# EasyEDA Pro project 转接隔离板.eprj

# Schematic 原理图

## Sheets
1 主控MCU: Board Name: 转接隔离板; Create Date: 2024-04-22; Page Name: 主控MCU; Project Name: 转接隔离板; Schematic Name: 原理图; Update Date: 2025-02-13; Company: 嘉立创EDA; Page Size: A3; Version: V1.0
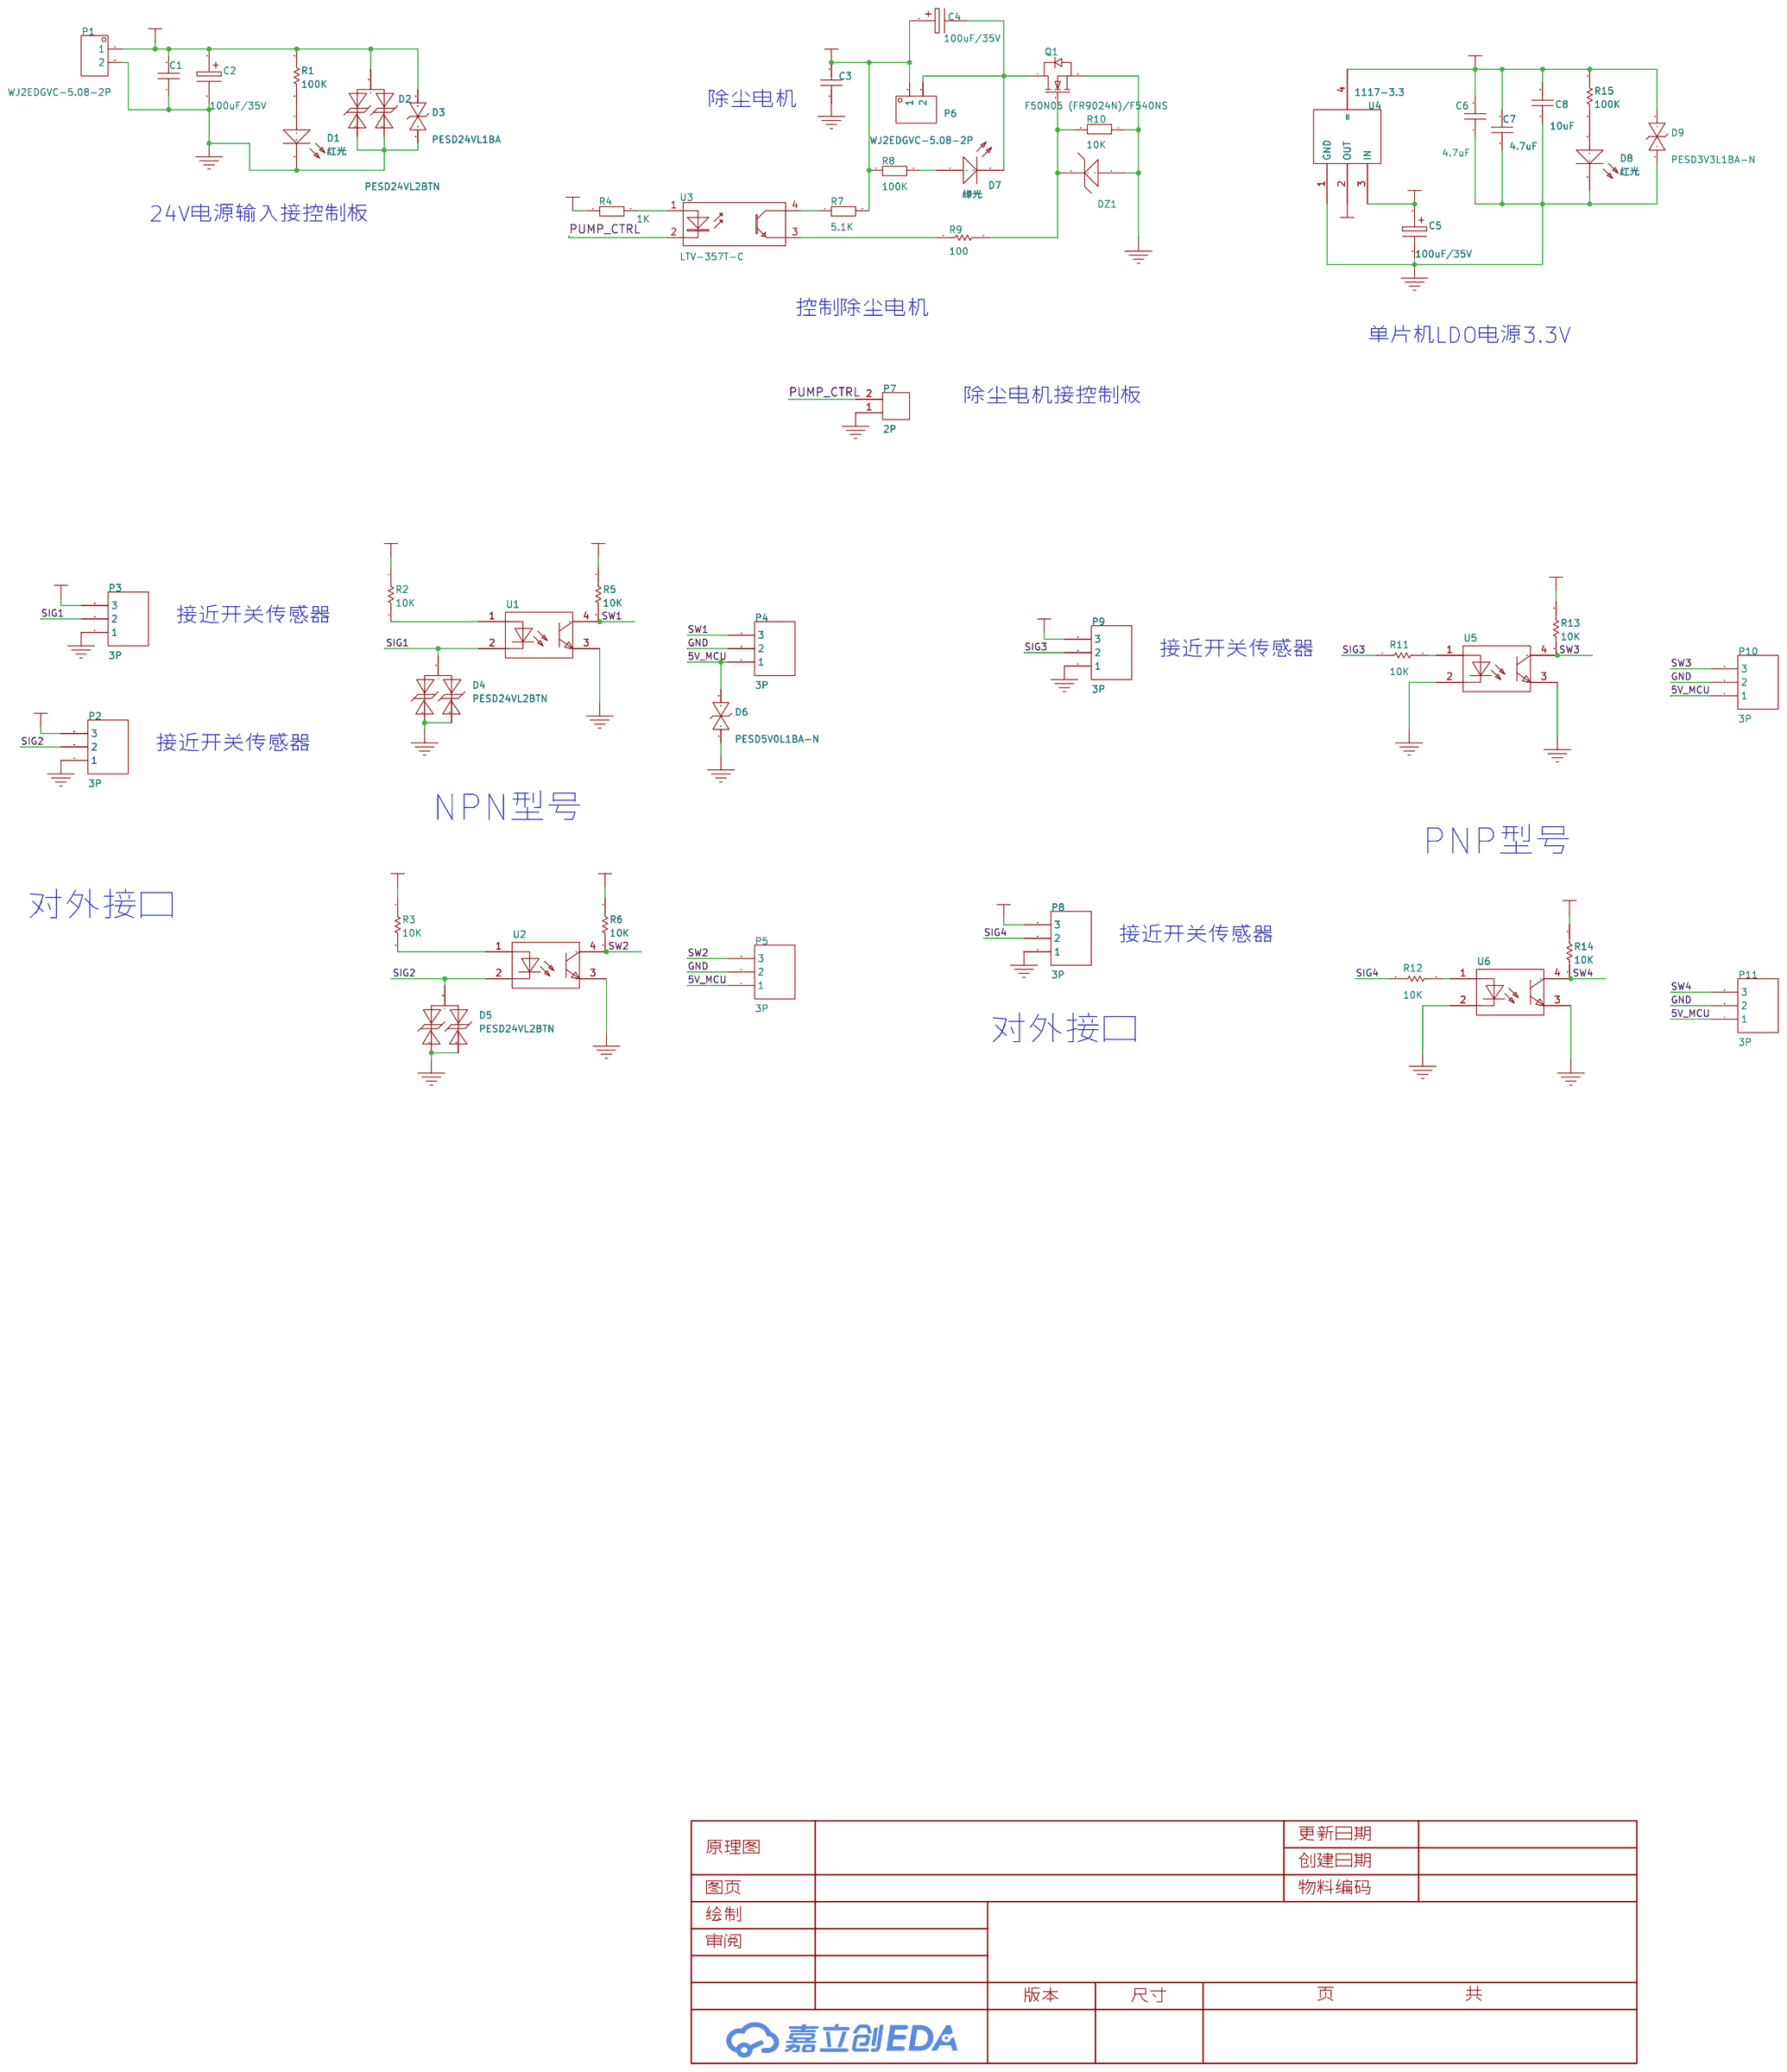
[diagram p0: 主控MCU]
2 电源及控制: Create Date: 2024-12-30; Page Name: 电源及控制; Update Date: 2025-01-07
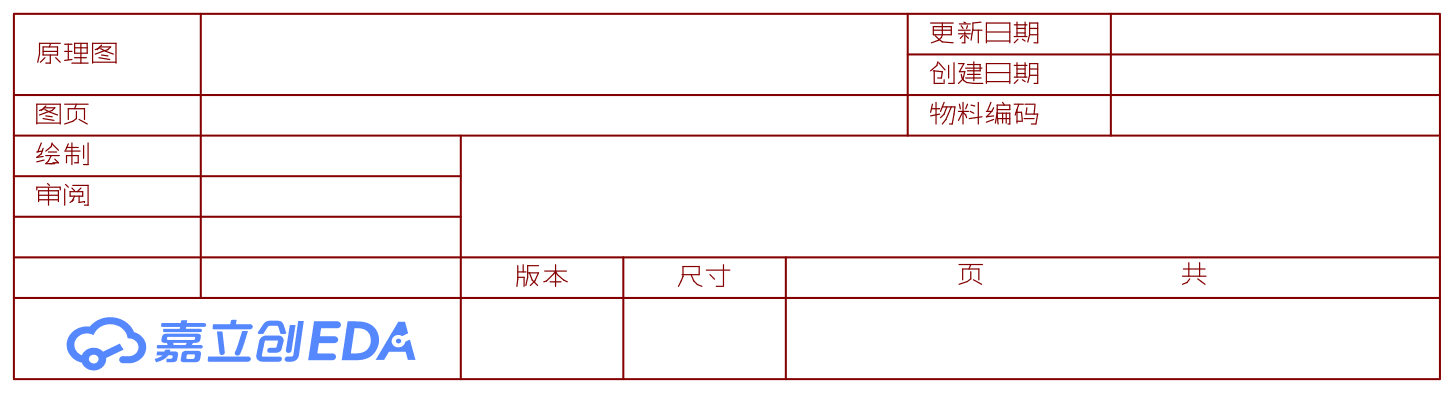
[diagram p1: 电源及控制]

## Parts
C1  104  [0603C]
C2  100uF/35V  [电解电容贴片6x6]
C3  104  [0603C]
C4  100uF/35V  [电解电容贴片6X6]
C5  100uF/35V  [电解电容贴片6X6]
C6  4.7uF  [C0805]
C7  4.7uF  [C0805]
C8  10uF  [C1206]
D1  红光  [0603LED]
D2  PESD24VL2BTN  [SOT-23-3_L2.9-W1.6-P1.90-LS2.8-BR]
D3  PESD24VL1BA  [SOD-323_L1.7-W1.3-LS2.5-BI]
D4  PESD24VL2BTN  [SOT-23-3_L2.9-W1.6-P1.90-LS2.8-BR]
D5  PESD24VL2BTN  [SOT-23-3_L2.9-W1.6-P1.90-LS2.8-BR]
D6  PESD5V0L1BA-N  [SOD-323_L1.7-W1.3-LS2.5-BI]
D7  绿光  [0603LED]
D8  红光  [0603LED]
D9  PESD3V3L1BA-N  [SOD-323_L1.7-W1.3-LS2.5-BI]
DZ1  --ѹ------SMAZ10V  [SMA]
P1  WJ2EDGVC-5.08-2P  [CONN-TH_WJ2EDGVC-5.08-2P]
P2  3P  [HDR1X3_CON]
P3  3P  [HDR1X3_CON]
P4  3P  [HDR1X3_CON]
P5  3P  [HDR1X3_CON]
P6  WJ2EDGVC-5.08-2P  [CONN-TH_WJ2EDGVC-5.08-2P]
P7  2P  [HDR1X2_CON]
P8  3P  [HDR1X3_CON]
P9  3P  [HDR1X3_CON]
P10  3P  [HDR1X3_CON]
P11  3P  [HDR1X3_CON]
Q1  F50N06 (FR9024N)/F540NS  [TO-263-2_L10.0-W9.1-P5.08-LS15.2-TL]
R1  100K  [0603R]
R2  10K  [0603R]
R3  10K  [0603R]
R4  1K  [0603R]
R5  10K  [0603R]
R6  10K  [0603R]
R7  5.1K  [0603R]
R8  100K  [0603R]
R9  100  [0603R]
R10  10K  [0603R]
R11  10K  [0603R]
R12  10K  [0603R]
R13  10K  [0603R]
R14  10K  [0603R]
R15  100K  [0603R]
U1  LTV-357T-C  [SOP-4_L4.4-W3.9-P2.54-LS7.0-TL]
U2  LTV-357T-C  [SOP-4_L4.4-W3.9-P2.54-LS7.0-TL]
U3  LTV-357T-C  [SOP-4_L4.4-W3.9-P2.54-LS7.0-TL]
U4  1117-3.3  [SOT-223]
U5  LTV-357T-C  [SOP-4_L4.4-W3.9-P2.54-LS7.0-TL]
U6  LTV-357T-C  [SOP-4_L4.4-W3.9-P2.54-LS7.0-TL]

## Library data of the parts
C1 C3 = 104: Origin Footprint 2: CAP; Origin Footprint 3: 0805C; Design Item ID: CAP; Library Name: SCH封装库
C2 = 100uF/35V: Origin Footprint 2: X47U; Origin Footprint 1: ________Ƭ6x6; Design Item ID: ELECTRO1; Library Name: *
C4 C5 = 100uF/35V: Origin Footprint 2: X47U; Origin Footprint 1: 电解电容贴片6x6; Design Item ID: ELECTRO1; Library Name: *
C6 C7 = 1206B475K500NT: 容值:4.7uF;精度:±10%;额定电压:50V;材质(温度系数):X7R;; LCSC Part Name: 4.7uF±10%50V; Supplier Part: C29823; Manufacturer: FH(风华); Supplier Footprint: 1206; JLCPCB Part Class: 基础库; Datasheet: https://atta.szlcsc.com/upload/public/pdf/source/20200305/C486355_26A10D38EF8C2A5C37091D0039909270.pdf; Supplier: LCSC; Tolerance: ±10%; Voltage Rated: 50V; Temperature Coefficient: X7R
C8 = 104: Capacitor (Semiconductor SIM Model); Published: 8-Jun-2000; LatestRevisionDate: 17-Jul-2002; LatestRevisionNote: Re-released for DXP Platform.; Publisher: Altium Limited; Origin Footprint 3: 0402; Origin Footprint 4: 1310[0504]; Origin Footprint 5: 1608[0603]; Origin Footprint 6: C1210; Origin Footprint 7: C0805; Origin Footprint 9: 0805; Origin Footprint 10: 0805L; Origin Footprint 1: 0603C; Design Item ID: Cap Semi; Library Name: Miscellaneous Devices
D1 D8 = 红光: Origin Footprint 2: LED(小); Design Item ID: LED; Library Name: SCH封装库
D2 D4 D5 = PESD24VL2BTN: Supplier Part: C314266; Manufacturer: BORN伯恩半导体; Supplier Footprint: SOT-23; JLCPCB Part Class: Extended Part; Datasheet: https://atta.szlcsc.com/upload/public/pdf/source/20181015/C314266_827961A24CE19193E9C29A410C67A84F.pdf; Supplier: LCSC; Polarity: Bidirectional; Voltage - Reverse Standoff (Typ): 24V (Max); Voltage - Breakdown (Min): 26.7V; Voltage - Clamping (Max) @ Ipp: 48V; Current - Peak Pulse (10/1000μs): 6A (8/20us)
D3 D6 D9 = PESD03V32D-LC: 极性:双向;反向截止电压(Vrwm):3.3V;最大钳位电压:16V;击穿电压:4V;; Supplier Part: C2912528; Manufacturer: TECH PUBLIC(台舟); Supplier Footprint: SOD-323; JLCPCB Part Class: 扩展库; Datasheet: https://atta.szlcsc.com/upload/public/pdf/source/20211102/817A196708C9E8A6CC27A16BC0CC1C1B.pdf; Supplier: LCSC; polarity: 双向; Reverse Stand-Off Voltage (Vrwm): 3.3V; Maximum Clamping Voltage: 16V; Breakdown Voltage: 4V; Reverse Leakage Current (Ir): 200nA; Number of Lines: 单路
D7 = 绿光: Origin Footprint 2: LED(小); Design Item ID: LED; Library Name: SCH封装库
DZ1 = ��ѹ������SMAZ10V: Design Item ID: --ѹ------; Library Name: SCH--װ--
P1 P6 = WJ2EDGVC-5.08-2P: LCSC Part Name: 1x2P 5.08mm 排数:1 每排P数:2; Supplier Part: C8445; Manufacturer: KANGNEX(康奈克斯电气); Supplier Footprint: 插件,P=5.08mm; JLCPCB Part Class: 扩展库; Datasheet: https://atta.szlcsc.com/upload/public/pdf/source/20191225/C8445_EB1D2D396D429FBA4C627FE17CC77AF0.pdf; Supplier: LCSC; Connector Type: 板端/插座-闭口; Structure: 1x2P; Pitch: 5.08mm; Color: 绿色; Mounting Style: 直针; Number of Pins: 2P; Number of Rows: 1; Number of PINs Per Row: 2; Current Rating (Max): 20A; Voltage Rating (Max): 450V; Contact Material: 黄铜; Contact Plating: 锡; Operating Temperature Range: -40℃~+105℃
P2-P5 P8-P11 = 3P: Library Name: SCH封装库
P7 = 2P: Library Name: SCH--װ--
Q1 = IRF540NSTRLPBF: LCSC Part Name: N沟道 100V 33A; Supplier Part: C23982; Manufacturer: Infineon(英飞凌); Supplier Footprint: D2PAK; JLCPCB Part Class: Extended Part; Datasheet: https://atta.szlcsc.com/upload/public/pdf/source/20140304/1457707006167.pdf; Supplier: LCSC; Type: N沟道; Drain Source Voltage (Vdss): 100V; Continuous Drain Current (Id): 33A; Power Dissipation (Pd): 130W; Drain Source On Resistance (RDS(on)@Vgs,Id): 44mΩ@10V,16A; Gate Threshold Voltage (Vgs(th)@Id): 4V@250μA
R1 R15 = 1K: Resistor; Published: 8-Jun-2000; LatestRevisionDate: 17-Jul-2002; LatestRevisionNote: Re-released for DXP Platform.; PackageReference: AXIAL-0.3; Publisher: Altium Limited; Origin Footprint 2: AXIAL-0.3; Origin Footprint 3: R0805; Origin Footprint 4: 0805R; Design Item ID: RES; Library Name: SCH封装库
R2 R3 R11 R12 = 470Ω: Resistor; Published: 8-Jun-2000; LatestRevisionDate: 17-Jul-2002; LatestRevisionNote: Re-released for DXP Platform.; PackageReference: AXIAL-0.3; Publisher: Altium Limited; Origin Footprint 2: AXIAL-0.3; Origin Footprint 3: R0805; Origin Footprint 4: 0805R; Design Item ID: RES; Library Name: SCH封装库
R4 = 2k: Origin Footprint 2: res; Origin Footprint 3: RES2; Origin Footprint 4: AXIAL-0.4; Origin Footprint 5: 0805R; Design Item ID: res; Library Name: MYLIB
R5 R6 R13 R14 = 10K: Resistor; Published: 8-Jun-2000; LatestRevisionDate: 17-Jul-2002; LatestRevisionNote: Re-released for DXP Platform.; PackageReference: AXIAL-0.3; Publisher: Altium Limited; Origin Footprint 2: AXIAL-0.3; Origin Footprint 3: R0805; Origin Footprint 4: 0805R; Design Item ID: RES; Library Name: SCH封装库
R7 = 5.1K: Origin Footprint 2: res; Origin Footprint 3: RES2; Origin Footprint 4: AXIAL-0.4; Origin Footprint 5: 0805R; Design Item ID: res; Library Name: MYLIB
R8 R10 = 10K: Origin Footprint 2: res; Origin Footprint 3: RES2; Origin Footprint 4: AXIAL-0.4; Origin Footprint 5: 0805R; Design Item ID: res; Library Name: MYLIB
R9 = 100: Resistor; Published: 8-Jun-2000; LatestRevisionDate: 17-Jul-2002; LatestRevisionNote: Re-released for DXP Platform.; PackageReference: AXIAL-0.3; Publisher: Altium Limited; Origin Footprint 2: AXIAL-0.3; Origin Footprint 3: R0805; Origin Footprint 4: 0805R; Design Item ID: RES; Library Name: SCH封装库
U1 U2 U5 U6 = LTV-357T-C: 输入电压类型:DC;正向电压:1.2V;输出电流:50mA;隔离电压(rms):3.75kV;反向电压:6V;接收端电压:35V;输出通道数:1;集射极饱和电压(Vce(sat)@Ic,IF):200mV@1mA,20mA;; Supplier: LCSC; Manufacturer: LITEON(光宝); Supplier Part: C119091; JLCPCB Part Class: 扩展库; LCSC Part Name: DC输入隔离电压(rms):3750V; Supplier Footprint: SOP-4-2.54mm; Datasheet: https://atta.szlcsc.com/upload/public/pdf/source/20170930/C133128_1506736380934997376.pdf; Input voltage type: DC; Output Type: 光电三极管; Forward Voltage: 1.2V; Output Current: 50mA; Isolation Voltage(rms): 3.75kV; Reverse Voltage: 6V; Receiving End Voltage: 35V; Number of Outputs: 1; Collector-Emitter Saturation Voltage (Vce(sat)@Ic,IF): 200mV@1mA,20mA; Rise time: 4us@2mA,100Ω; Fall time: 3us@2mA,100Ω; Operating Temperature: -55℃~+110℃
U3 = EL357N/PC817: 4-Pin Phototransistor Optocoupler; Published: 24-Mar-1999; LatestRevisionDate: 04-Mar-2005; LatestRevisionNote: Sch pins 3 &amp; 4 Swapped.; DatasheetVersion: Nov-2003; PackageReference: DIP-4; Publisher: Altium Limited; Design Item ID: Optoisolator1; Library Name: Miscellaneous Devices
U4 = 1117-3.3: Design Item ID: LM1117; Library Name: Party600

## Nets
3V3: C6.2 C7.2 C8.2 D9.2 R4.1 R5.1 R6.1 R13.1 R14.1 R15.1 U4.2(OUT) U4.4(=)
5V_MCU: C5.1 D6.2 P4.1 P5.1 P10.1 P11.1 U4.3(IN)
24V: C1.2 C2.1 C3.2 C4.1 D2.3(A) D3.2 P1.1 P2.3 P3.3 P6.1 P8.3 P9.3 R1.1 R2.1 R3.1 R7.2 R8.1
GND: C1.1 C2.2 C3.1 C5.2 C6.1 C7.1 C8.1 D1.2 D2.1(K) D2.2(K) D3.1 D4.1(K) D4.2(K) D5.1(K) D5.2(K) D6.1 D8.2 D9.1 DZ1.1 P1.2 P2.1 P3.1 P4.2 P5.2 P7.1 P8.1 P9.1 P10.2 P11.2 Q1.3(S) R10.1 U1.3 U2.3 U4.1(GND) U5.2 U5.3 U6.2 U6.3
PUMP_CTRL: P7.2 U3.2(K)
SIG1: D4.3(A) P3.2 U1.2
SIG2: D5.3(A) P2.2 U2.2
SIG3: P9.2 R11.1
SIG4: P8.2 R12.1
SW1: P4.3 R5.2 U1.4
SW2: P5.3 R6.2 U2.4
SW3: P10.3 R13.2 U5.4
SW4: P11.3 R14.2 U6.4
$1N25579: R2.2 U1.1
$1N46541: D8.1 R15.2
$1N47733: R4.2 U3.1(A)
$1N47734: R7.1 U3.4(C)
$1N47735: D7.1 R8.2
$1N47736: C4.2 D7.2 P6.2 Q1.4(D)
$1N47741: R9.2 U3.3(E)
$1N47742: DZ1.2 Q1.1(G) R9.1 R10.2
$1N48159: R3.2 U2.1
$1N49326: D1.1 R1.2
$1N50168: R12.2 U6.1
$1N50320: R11.2 U5.1

## Notes on the sheets
sheet 1
- 除尘电机
- 24V电源输入接控制板
- 控制除尘电机
- 单片机LDO电源3.3V
- 除尘电机接控制板
- 接近开关传感器
- 接近开关传感器
- 接近开关传感器
- NPN型号
- PNP型号
- 对外接口
- 接近开关传感器
- 对外接口

# Board PCB
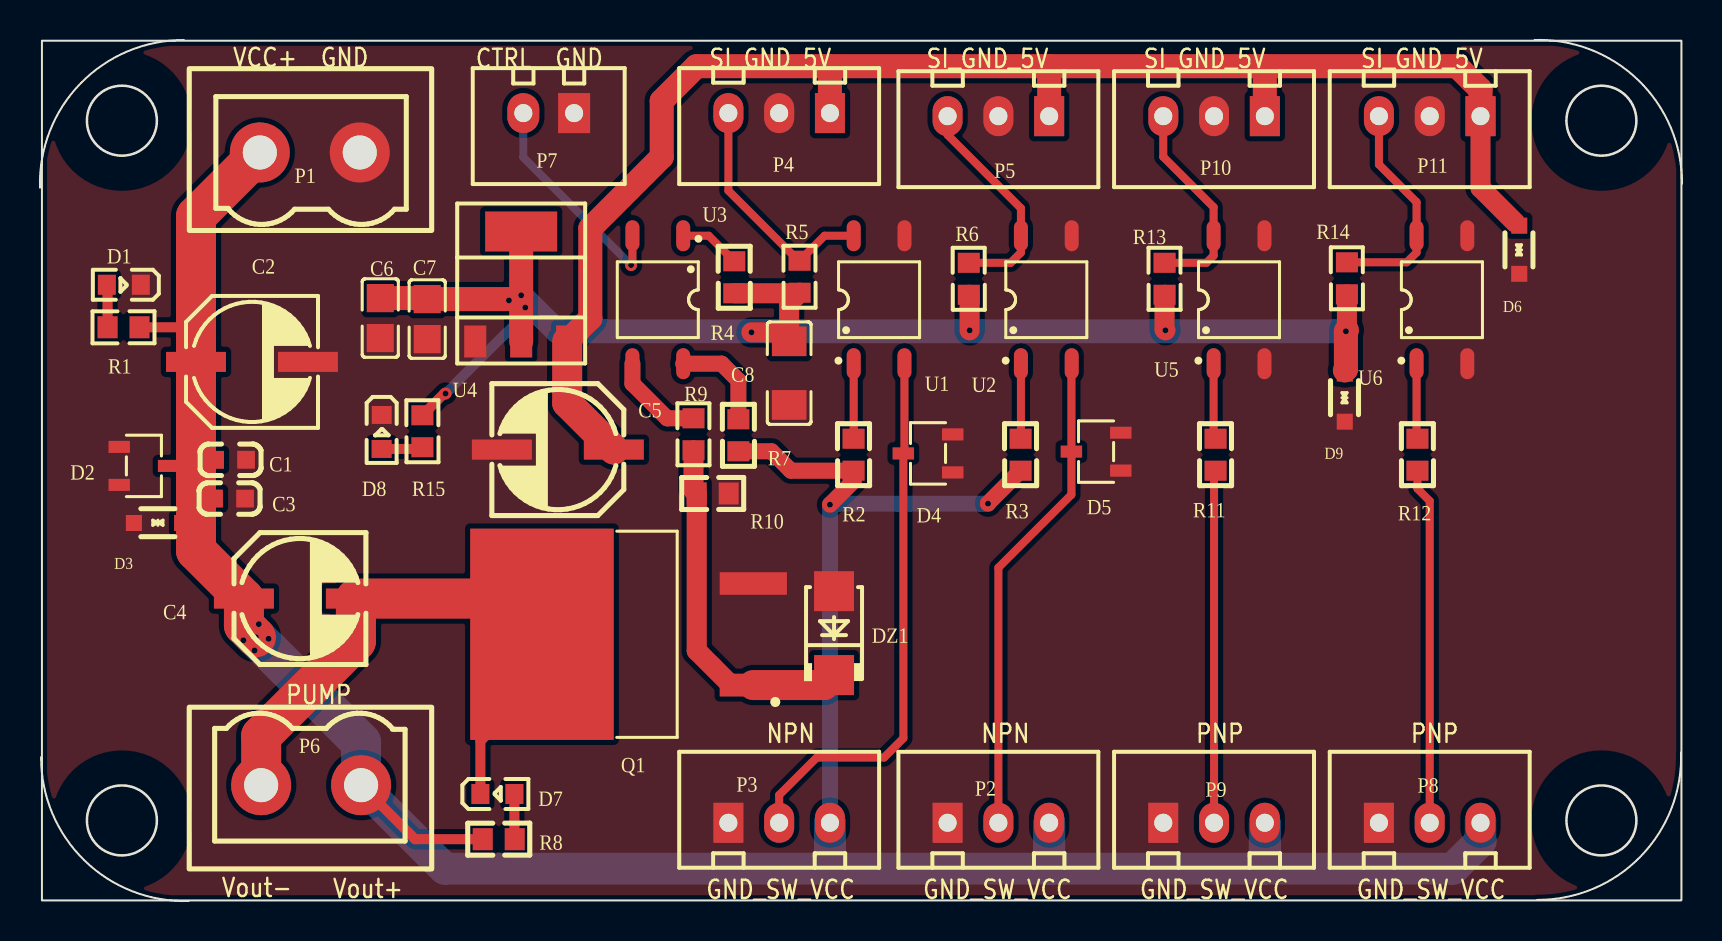
[diagram p2: board, top side]
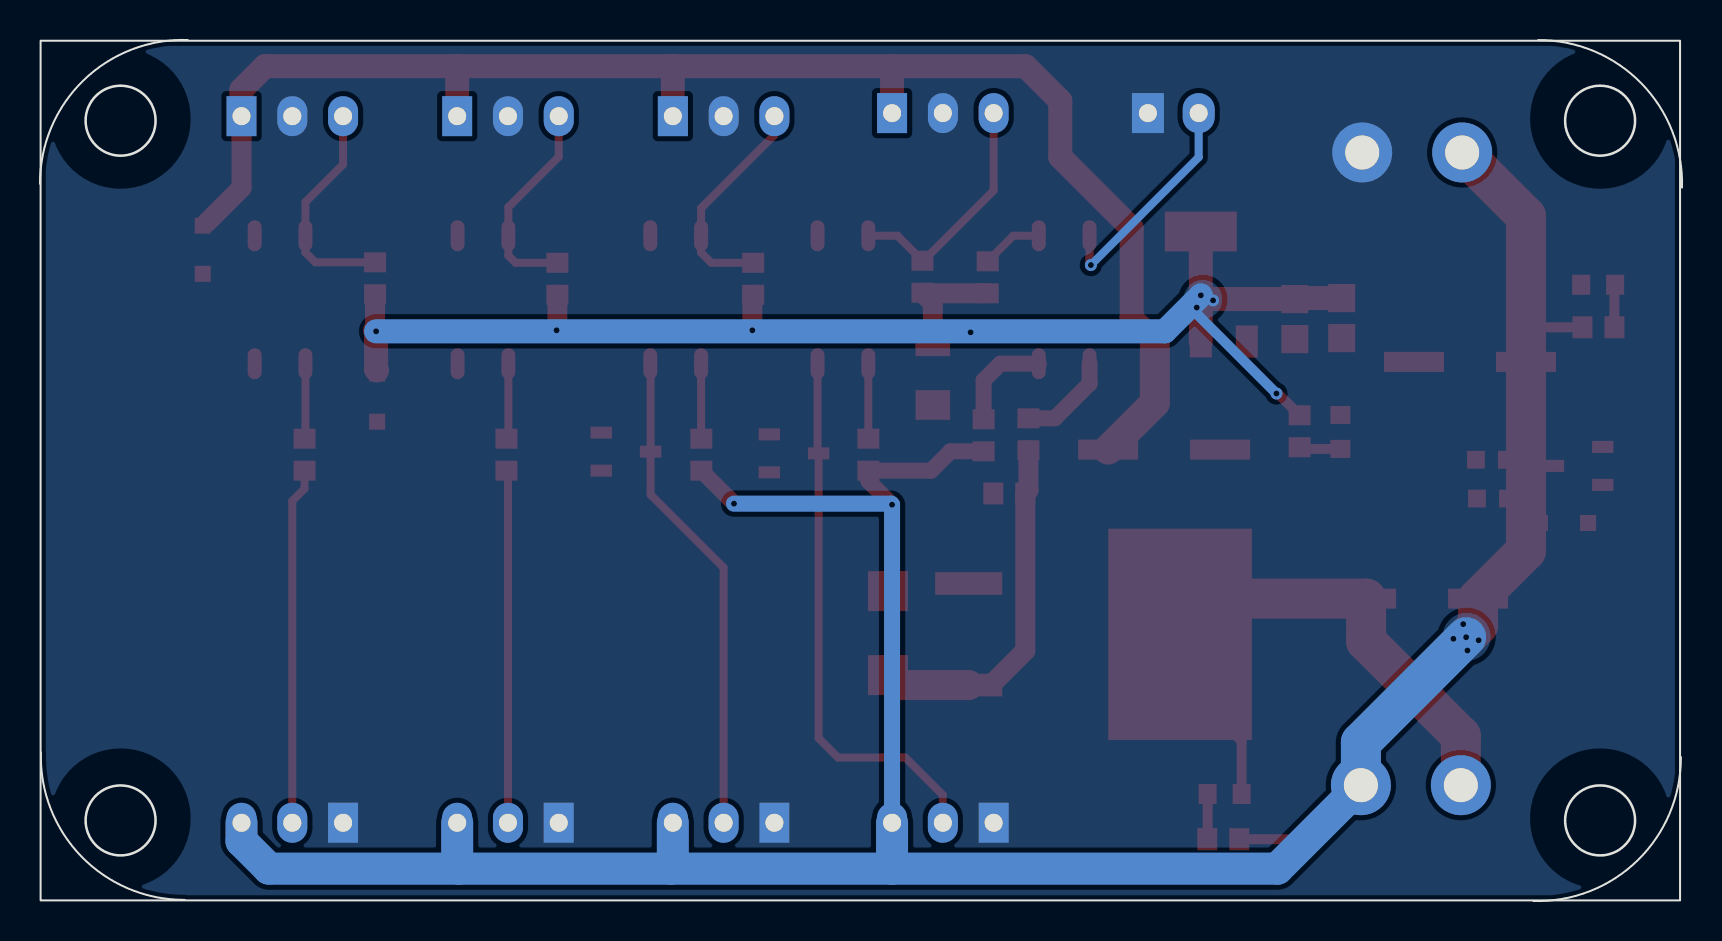
[diagram p3: board, bottom side, seen from below]

Outline 82.13 x 43.07 mm; copper layers: Top Layer, Bottom Layer. Coordinates in mm from the lower left corner of the outline.
Outline path: rectangle 0.1,43.03 82.1,0.03 ; circle c4.1,39.03 r1.75 ; circle c4.1,4.03 r1.75 ; circle c78.1,39.03 r1.75 ; circle c78.1,4.03 r1.75 ; 0,35.68 arc(2.03,40.9) 7.19,43.06 ; 7.44,0 arc(2.22,2.03) 0.06,7.2 ; 74.75,43.07 arc(79.96,41.04) 82.13,35.87 ; 82.08,7.44 arc(80.05,2.22) 74.89,0.06
Stack: Top Layer 0.035mm / Dielectric1 1.51mm FR4 er 4.5 / Bottom Layer 0.035mm

## Design rules (mm)
template: 用户自定义配置
spacing Default (default): track to track 0.152, other pairs 0 to 0.152
track width Default (default): min 0.254, default 0.254, max 25.4
differential pair differentialPair (default): width min 0.127, default 0.254, max 2.54; gap min 0.152, default 0.152
via Default (default): diameter min 0.25, default 0.61, max 100.025; hole min 0.2, default 0.305, max 59.995

## Placement (name value [footprint] x y rotation side)
C1  104  [0603C]  9.53 22.07 180 top
C2  100uF/35V  [电解电容贴片6x6]  10.6 26.97 0 top
C3  104  [0603C]  9.48 20.13 180 top
C4  100uF/35V  [电解电容贴片6X6]  13 15.13 0 top
C5  100uF/35V  [电解电容贴片6X6]  25.9 22.58 180 top
C6  4.7uF  [C0805]  17.02 29.16 90 top
C7  4.7uF  [C0805]  19.37 29.11 90 top
C8  10uF  [C1206]  37.47 26.4 90 top
D1  红光  [0603LED]  4.23 30.84 0 top
D2  PESD24VL2BTN  [SOT-23-3_L2.9-W1.6-P1.90-LS2.8-BR]  5.2 21.76 180 top
D3  PESD24VL1BA  [SOD-323_L1.7-W1.3-LS2.5-BI]  5.9 18.91 0 top
D4  PESD24VL2BTN  [SOT-23-3_L2.9-W1.6-P1.90-LS2.8-BR]  44.42 22.39 0 top
D5  PESD24VL2BTN  [SOT-23-3_L2.9-W1.6-P1.90-LS2.8-BR]  52.82 22.48 0 top
D6  PESD5V0L1BA-N  [SOD-323_L1.7-W1.3-LS2.5-BI]  73.99 32.58 90 top
D7  绿光  [0603LED]  22.84 5.34 180 top
D8  红光  [0603LED]  17.07 23.5 90 top
D9  PESD3V3L1BA-N  [SOD-323_L1.7-W1.3-LS2.5-BI]  65.26 25.18 90 top
DZ1  --ѹ------SMAZ10V  [SMA]  39.72 13.4 90 top
P1  WJ2EDGVC-5.08-2P  [CONN-TH_WJ2EDGVC-5.08-2P]  13.5 37.44 0 top
P2  3P  [HDR1X3_CON]  47.94 3.91 0 top
P3  3P  [HDR1X3_CON]  36.97 3.91 0 top
P4  3P  [HDR1X3_CON]  36.97 39.41 180 top
P5  3P  [HDR1X3_CON]  47.94 39.26 180 top
P6  WJ2EDGVC-5.08-2P  [CONN-TH_WJ2EDGVC-5.08-2P]  13.56 5.79 180 top
P7  2P  [HDR1X2_CON]  25.44 39.41 180 top
P8  3P  [HDR1X3_CON]  69.51 3.91 0 top
P9  3P  [HDR1X3_CON]  58.72 3.91 0 top
P10  3P  [HDR1X3_CON]  58.72 39.26 180 top
P11  3P  [HDR1X3_CON]  69.51 39.26 180 top
Q1  F50N06 (FR9024N)/F540NS  [TO-263-2_L10.0-W9.1-P5.08-LS15.2-TL]  30.39 13.34 180 top
R1  100K  [0603R]  4.18 28.7 180 top
R2  10K  [0603R]  40.69 22.32 90 top
R3  10K  [0603R]  49.05 22.32 90 top
R4  1K  [0603R]  34.73 31.2 90 top
R5  10K  [0603R]  37.99 31.23 90 top
R6  10K  [0603R]  46.46 31.12 90 top
R7  5.1K  [0603R]  34.93 23.29 270 top
R8  100K  [0603R]  22.94 3.09 0 top
R9  100  [0603R]  32.69 23.34 90 top
R10  10K  [0603R]  33.65 20.39 180 top
R11  10K  [0603R]  58.8 22.32 90 top
R12  10K  [0603R]  68.9 22.32 90 top
R13  10K  [0603R]  56.25 31.12 90 top
R14  10K  [0603R]  65.37 31.15 90 top
R15  100K  [0603R]  19.13 23.5 270 top
U1  LTV-357T-C  [SOP-4_L4.4-W3.9-P2.54-LS7.0-TL]  41.97 30.08 90 top
U2  LTV-357T-C  [SOP-4_L4.4-W3.9-P2.54-LS7.0-TL]  50.33 30.08 90 top
U3  LTV-357T-C  [SOP-4_L4.4-W3.9-P2.54-LS7.0-TL]  30.9 30.08 270 top
U4  1117-3.3  [SOT-223]  24.07 30.69 0 top
U5  LTV-357T-C  [SOP-4_L4.4-W3.9-P2.54-LS7.0-TL]  59.97 30.08 90 top
U6  LTV-357T-C  [SOP-4_L4.4-W3.9-P2.54-LS7.0-TL]  70.12 30.08 90 top

## Footprints (pads in the part's own frame, mm; a bottom-side part is the same pattern mirrored in y, then rotated)
0603C
  rect 0.889x0.889 smd: 1(-0.774,0) 2(0.774,0)
0603LED
  rect 0.9x1 smd: 1(-0.884,-0.017) 2(0.816,-0.017)
0603R
  rect 1x1.1 smd: 1(-0.8,0) 2(0.8,0)
C0805
  rect 1.41x1.35 smd: 1(-1,0) 2(1,0)
C1206
  rect 1.485x1.728 smd: 1(-1.593,0) 2(1.593,0)
CONN-TH_WJ2EDGVC-5.08-2P
  round 3 hole 1.7: 1(-2.499,0) 2(2.499,0)
HDR1X2_CON
  rect 1.6x2 hole 0.9: 1(-1.27,0)
  oval 1.6x2 hole 0.9: 2(1.27,0)
HDR1X3_CON
  rect 1.5x2 hole 0.9: 1(-2.54,0)
  oval 1.5x2 hole 0.9: 2(0,0) 3(2.54,0)
SMA
  rect 2x2 smd: 1(2.1,0) 2(-2.1,0)
SOD-323_L1.7-W1.3-LS2.5-BI
  rect 0.8x0.8 smd: 1(-1.205,0) 2(1.205,0)
SOP-4_L4.4-W3.9-P2.54-LS7.0-TL
  oval 1.55x0.7 smd: 1(-3.2,1.27) 2(-3.2,-1.27) 3(3.2,-1.27) 4(3.2,1.27)
SOT-23-3_L2.9-W1.6-P1.90-LS2.8-BR
  rect 1.07x0.6 smd: 1(1.235,-0.95) 2(1.235,0.95) 3(-1.235,0)
SOT-223
  rect 1.1x1.6 smd: 1(-2.3,-2.7) 2(0,-2.7) 3(2.3,-2.7)
  rect 3.6x2 smd: 4(0,2.8)
TO-263-2_L10.0-W9.1-P5.08-LS15.2-TL
  rect 3.358x1.134 smd: 1(-5.286,2.54) 3(-5.286,-2.54)
  rect 7.181x10.566 smd: 4(5.286,0)
电解电容贴片6X6
  rect 3x1 smd: 1(-2.8,0) 2(2.8,0)
电解电容贴片6x6
  rect 3x1 smd: 1(-2.8,0) 2(2.8,0)

## Nets
As in the schematic.

## Via types
v1: diameter 0.6, hole 0.3, Top Layer to Bottom Layer, 16 vias

## Routing (per net, layer and track width the routed paths; a pad name or vN(x,y) marks a point on that pad's centre or on a via; arc(x,y) is an arc through that point)
3V3: length 77.6
  Top Layer w0.5: R15.1 20.21,25.38 v1(20.28,25.38)
  Top Layer w1: R13.1 56.25,28.59 v1(56.29,28.55) ; v1(35.58,28.44) 37.02,28.44 C8.2 37.47,29.91 37.96,30.4 ; 37.96,30.4 R5.1 ; 37.96,30.4 R4.1 ; R6.1 46.5,30.28 v1(46.5,28.55) ; R14.1 65.37,28.55
  Top Layer w1.2: v1(24.07,30.3) U4.2 ; v1(24.07,30.3) U4.4 ; v1(24.07,30.3) 23.88,30.11 C7.2 19.31,30.16 C6.2 ; 65.37,28.55 v1(65.32,28.5) 65.32,26.59 65.27,26.54
  Bottom Layer w0.5: v1(20.28,25.38) 24.27,29.37 v1(24.27,29.68)
  Bottom Layer w1.2: v1(65.32,28.5) 25.87,28.5 v1(24.07,30.3)
  vias: v1(23.46,30.04)
5V_MCU: length 77.3
  Top Layer w1: P11.1 72.05,35.67 73.78,33.94
  Top Layer w1.2: P4.1 39.51,41.74 39.5,41.76 ; P11.1 72.05,40.58 70.88,41.76 61.29,41.76 ; 61.29,41.76 61.26,41.73 P10.1 ; 61.29,41.76 50.51,41.76 ; P5.1 50.48,41.72 50.51,41.76 ; 50.51,41.76 39.5,41.76 ; 39.5,41.76 32.83,41.76 31.1,40.02 31.1,37.22 27.53,33.65 27.53,29.15 U4.3
  Top Layer w1.5: U4.3 26.37,24.92 C5.1
24V: length 148.1
  Top Layer w0.5: P6.1 18.76,3.09 R8.1 ; R1.1 7.43,28.7 ; 7.8,21.73 7.77,21.76 D2.3
  Top Layer w0.8: v1(39.51,19.83) 40.69,21.01 R2.1 37.56,21.52 36.59,22.49 34.93,22.49 ; v1(47.42,19.88) 47.42,19.89 R3.1
  Top Layer w2: P1.1 7.8,34.25 C2.1 7.8,17.52 C4.1 10.2,13.79 v1(10.8,13.2)
  Bottom Layer w0.8: P3.3 v1(39.51,19.83) 39.56,19.88 v1(47.42,19.88)
  Bottom Layer w1.6: P2.3 50.48,1.72 50.57,1.62 ; 39.52,1.62 20.24,1.62 P6.1 ; 39.52,1.62 50.57,1.62 ; 39.52,1.62 39.51,1.62 P3.3 ; 50.57,1.62 61.17,1.62 ; 61.17,1.62 70.67,1.62 72.05,2.99 P8.3 ; 61.17,1.62 61.26,1.71 P9.3
  Bottom Layer w2: P6.1 16.06,7.93 v1(10.8,13.2)
  vias: v1(10.17,13.04) v1(10.73,12.53) v1(10.94,13.85) v1(11.43,13.12)
PUMP_CTRL: length 11.3
  Top Layer w0.4: v1(29.57,31.81) 29.63,31.88 U3.2
  Bottom Layer w0.4: v1(29.57,31.81) 24.17,37.2 P7.2
SIG1: length 27.5
  Top Layer w0.4: P3.2 36.97,5.3 38.85,7.18 42.21,7.18 43.18,8.15 43.18,22.39 D4.3 43.24,22.45 43.24,26.88
SIG2: length 24.5
  Top Layer w0.4: 51.6,26.88 51.59,26.86 D5.3 51.59,20.32 47.94,16.67 P2.2
SIG3: length 17.6
  Top Layer w0.4: R11.1 58.72,21.45 P9.2
SIG4: length 17.9
  Top Layer w0.4: P8.2 69.51,20.01 68.9,20.62 R12.1
SW1: length 12.1
  Top Layer w0.4: P4.3 34.43,35.54 37.94,32.03 R5.2 39.24,33.28 U1.4
SW2: length 11.2
  Top Layer w0.4: R6.2 48.55,31.92 49.06,32.44 U2.4 49.06,34.65 45.4,38.32 P5.3
SW3: length 10.6
  Top Layer w0.4: R13.2 58.34,31.92 58.7,32.28 U5.4 58.7,34.7 56.18,37.22 P10.3
SW4: length 11.3
  Top Layer w0.4: P11.3 66.97,36.84 68.85,34.96 U6.4 68.85,32.44 68.36,31.95 R14.2
$1N25579: length 3.8
  Top Layer w0.4: 40.7,26.88 40.7,23.13 R2.2
$1N46541: length 2.1
  Top Layer w0.5: 19.13,22.7 19.04,22.61 D8.1
$1N47733: length 3.1
  Top Layer w0.4: U3.1 33.45,33.28 34.73,32
$1N47734: length 5.1
  Top Layer w0.8: 32.17,26.88 34.09,26.88 34.93,26.04 R7.1
$1N47735: length 2.3
  Top Layer w0.5: D7.1 23.73,3.11 R8.2
$1N47736: length 30.6
  Top Layer w0.5: Q1.4 25.11,11.08 22.03,8 D7.2
  Top Layer w2: P6.2 11.06,8.26 15.8,13 C4.2 23.32,15.13 Q1.4
$1N47741: length 4.8
  Top Layer w0.8: R9.2 31.37,24.14 29.63,25.88 29.63,26.88
$1N47742: length 17.9
  Top Layer w1: R9.1 32.69,20.55 R10.2 32.85,12.52 34.56,10.8 Q1.1
  Top Layer w1.5: Q1.1 39.22,10.8 DZ1.2
$1N48159: length 3.8
  Top Layer w0.4: 49.06,26.88 49.06,23.14 R3.2
$1N49326: length 2.1
  Top Layer w0.5: D1.1 3.38,30.79 R1.2
$1N50168: length 3.8
  Top Layer w0.4: 68.85,26.88 68.85,23.17 R12.2
$1N50320: length 3.8
  Top Layer w0.4: R11.2 58.7,23.22 58.7,26.88

## Copper pours and planes (outline as drawn; the poured copper is in the pictures)
3V3 on Bottom Layer: 23,31.06 24.93,31.06 24.93,29.13 23,29.13
24V on Bottom Layer: 9.58,14.41 11.97,14.41 11.97,12.02 9.58,12.02
GND on Top Layer: -0.94,44.05 83.01,44.05 83.01,-1.24 -0.94,-1.24
GND on Bottom Layer: -1.19,44.56 82.65,44.56 82.65,-0.47 -1.19,-0.47

## Text on the board
Top Silkscreen Layer: Vout- | VCC+__GND | PUMP | Vout+ | CTRL__GND | GND_SW_VCC | SI_GND_5V | NPN | PNP
